# Altium schematic sheet 28pins_Antariksh_unoR3_V1I1_Schematic.SchDoc (part 4 of 5)
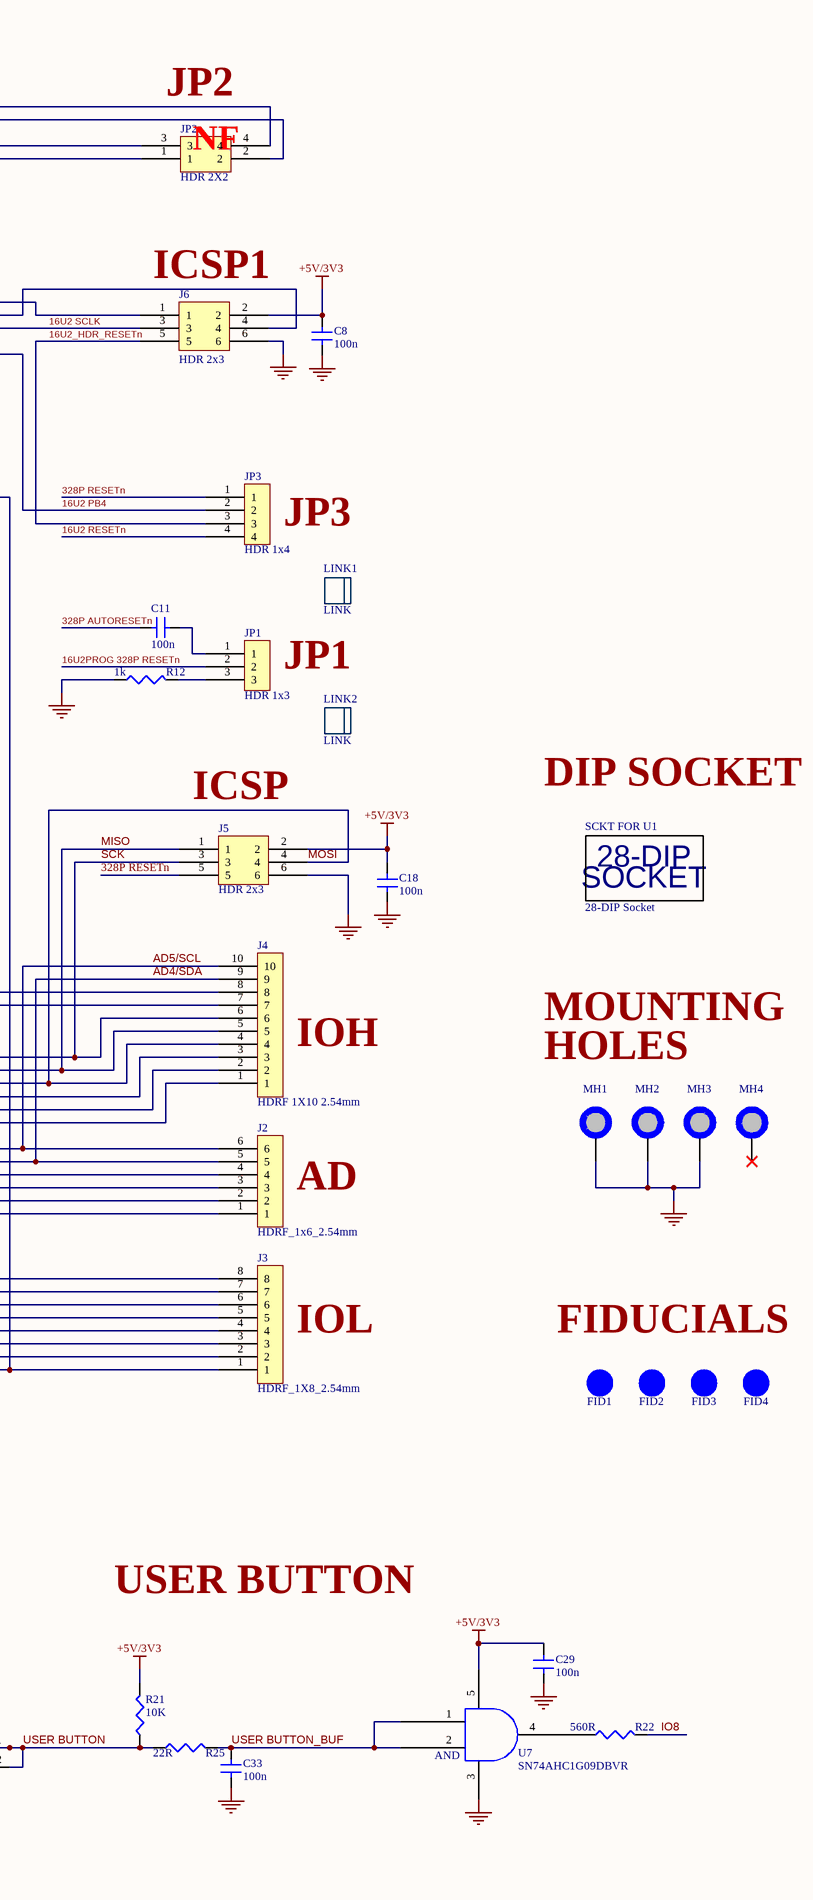
[diagram p4: 28pins_Antariksh_unoR3_V1I1_Schematic.SchDoc, right]

## Library data of the parts (continued)
R9 R16 = RC0805FR-071ML: 125Mw Thick Film Resistors 100Ppm/ 1% 1M 0805 Chip Resistor Surface Mount Rohs; Manufacturer: Yageo Group; Resistance: 1MΩ; Temperature Coefficient: 100ppm/°C; Voltage Rating: 150V; Supplier 1: Avnet; Manufacturer Part Number: RC0805FR-071ML; RoHS: Compliant; Category: Chip SMD Resistors; Stock 1: 5000; Pricing 1: 5000=0.00231, 10000=0.00225, 20000=0.0022, 30000=0.00216, 40000=0.00211 (USD); Case/Package: 0805; Case Code (Imperial): 0805; China RoHS: Non-Compliant; Composition: Thick Film; Depth: 1.25mm; Features: Moisture Resistant; Height: 500µm; Lead Free: Lead Free; Length: 2mm; Lifecycle Status: Production; Max Operating Temperature: 155°C; Max Power Dissipation: 125mW; Military Standard: Not; Min Operating Temperature: -55°C; Mount: Surface Mount; Number of Pins: 2; Number of Terminals: 2; Number of Terminations: 2; Packaging: Tape & Reel; Power Dissipation: 125mW; Power Rating: 125mW; REACH SVHC: Yes; Schedule B: 8533210045, 8533210045|8533210045, 8533210045|8533210045|8533210045, 8533210045|8533210045|8533210045|8533210045; Termination: SMD/SMT; Tolerance: 1%; Voltage Rating (AC): 150V; Voltage Rating (DC): 150V; Width: 1.25mm; Working Voltage: 150V; ComponentLink1URL: https://datasheet.octopart.com:443/RC0805FR-071ML-Yageo-datasheet-175887523.pdf?src-supplier=IHS; ComponentLink1Description: https://datasheet.octopart.com:443/RC0805FR-071ML-Yageo-datasheet-175887523.pdf?src-supplier=IHS; ComponentLink2URL: https://datasheet.octopart.com:443/RC0805FR-071ML-Yageo-datasheet-103092701.pdf?src-supplier=Upverter; ComponentLink2Description: https://datasheet.octopart.com:443/RC0805FR-071ML-Yageo-datasheet-103092701.pdf?src-supplier=Upverter; ComponentLink3URL: https://datasheet.octopart.com:443/RC0805FR-071ML-Yageo-datasheet-79472498.pdf?src-supplier=Upverter; ComponentLink3Description: https://datasheet.octopart.com:443/RC0805FR-071ML-Yageo-datasheet-79472498.pdf?src-supplier=Upverter; ComponentLink4URL: https://datasheet.octopart.com:443/RC0805FR-071ML-Yageo-datasheet-8330313.pdf?src-supplier=element14+APAC; ComponentLink4Description: https://datasheet.octopart.com:443/RC0805FR-071ML-Yageo-datasheet-8330313.pdf?src-supplier=element14+APAC; ComponentLink5URL: https://datasheet.octopart.com:443/RC0805FR-071ML-Yageo-datasheet-62067350.pdf?src-supplier=Farnell; ComponentLink5Description: https://datasheet.octopart.com:443/RC0805FR-071ML-Yageo-datasheet-62067350.pdf?src-supplier=Farnell; ComponentLink6URL: https://datasheet.octopart.com:443/RC0805FR-071ML-Yageo-datasheet-13691069.pdf?src-supplier=Farnell; ComponentLink6Description: https://datasheet.octopart.com:443/RC0805FR-071ML-Yageo-datasheet-13691069.pdf?src-supplier=Farnell; ComponentLink7URL: https://datasheet.octopart.com:443/RC0805FR-071ML-Yageo-datasheet-164759695.pdf?src-supplier=Future+Electronics; ComponentLink7Description: https://datasheet.octopart.com:443/RC0805FR-071ML-Yageo-datasheet-164759695.pdf?src-supplier=Future+Electronics; ComponentLink8URL: https://datasheet.octopart.com:443/RC0805FR-071ML-Yageo-datasheet-127823281.pdf?src-supplier=Future+Electronics; ComponentLink8Description: https://datasheet.octopart.com:443/RC0805FR-071ML-Yageo-datasheet-127823281.pdf?src-supplier=Future+Electronics; ComponentLink9URL: https://datasheet.octopart.com:443/RC0805FR-071ML-Yageo-datasheet-137700087.pdf?src-supplier=Future+Electronics; ComponentLink9Description: https://datasheet.octopart.com:443/RC0805FR-071ML-Yageo-datasheet-137700087.pdf?src-supplier=Future+Electronics; ComponentLink10URL: https://datasheet.octopart.com:443/RC0805FR-071ML-Yageo-datasheet-12592811.pdf?src-supplier=Future+Electronics; ComponentLink10Description: https://datasheet.octopart.com:443/RC0805FR-071ML-Yageo-datasheet-12592811.pdf?src-supplier=Future+Electronics; ComponentLink11URL: https://datasheet.octopart.com:443/RC0805FR-071ML-Yageo-datasheet-8324252.pdf?src-supplier=Future+Electronics; ComponentLink11Description: https://datasheet.octopart.com:443/RC0805FR-071ML-Yageo-datasheet-8324252.pdf?src-supplier=Future+Electronics; ComponentLink12URL: https://datasheet.octopart.com/RC0805FR-071ML-Yageo-datasheet-73766026.pdf; ComponentLink12Description: https://datasheet.octopart.com/RC0805FR-071ML-Yageo-datasheet-73766026.pdf; ComponentLink13URL: https://datasheet.octopart.com:443/RC0805FR-071ML-Yageo-datasheet-118657.pdf?src-supplier=DigiKey; ComponentLink13Description: https://datasheet.octopart.com:443/RC0805FR-071ML-Yageo-datasheet-118657.pdf?src-supplier=DigiKey; ComponentLink14URL: https://datasheet.octopart.com:443/RC0805FR-071ML-Yageo-datasheet-502840.pdf?src-supplier=element14; ComponentLink14Description: https://datasheet.octopart.com:443/RC0805FR-071ML-Yageo-datasheet-502840.pdf?src-supplier=element14; ComponentLink15URL: http://sigma.octopart.com:80/rohs_statement/Yageo-company-2.pdf?src-supplier=Compliance+Statements; ComponentLink15Description: http://sigma.octopart.com:80/rohs_statement/Yageo-company-2.pdf?src-supplier=Compliance+Statements; ComponentLink16URL: http://sigma.octopart.com:80/conflict_mineral_statement/Yageo-company-3.pdf?src-supplier=Compliance+Statements; ComponentLink16Description: http://sigma.octopart.com:80/conflict_mineral_statement/Yageo-company-3.pdf?src-supplier=Compliance+Statements; Supplier Part Number 1: RC0805FR-071ML
R10-R12 = RC0805FR-071KL: 125Mw Thick Film Resistors 100Ppm/ 1% 1K 0805 Chip Resistor Surface Mount Rohs; Manufacturer: Yageo Group; Resistance: 1kΩ; Temperature Coefficient: 100ppm/°C; Voltage Rating: 150V; Supplier 1: Avnet; Manufacturer Part Number: RC0805FR-071KL; RoHS: Compliant; Category: Chip SMD Resistors; Stock 1: 2315000; Pricing 1: 5000=0.00231, 10000=0.00225, 20000=0.0022, 30000=0.00216, 40000=0.00211 (USD); Case/Package: 0805; Case Code (Imperial): 0805; China RoHS: Non-Compliant; Composition: Thick Film; Depth: 1.25mm; Features: Moisture Resistant; Height: 500µm; Lead Free: Lead Free; Length: 2mm; Lifecycle Status: Production; Max Operating Temperature: 155°C; Max Power Dissipation: 125mW; Military Standard: Not; Min Operating Temperature: -55°C; Mount: Surface Mount; Number of Pins: 2; Number of Terminals: 2; Number of Terminations: 2; Packaging: Tape & Reel; Power Dissipation: 125mW; Power Rating: 125mW; REACH SVHC: Yes; Schedule B: 8533210045, 8533210045|8533210045, 8533210045|8533210045|8533210045, 8533210045|8533210045|8533210045|8533210045; Termination: SMD/SMT; Tolerance: 1%; Voltage Rating (AC): 150V; Voltage Rating (DC): 150V; Width: 1.25mm; Working Voltage: 150V; ComponentLink1URL: https://datasheet.octopart.com:443/RC0805FR-071KL-Yageo-datasheet-175887523.pdf?src-supplier=IHS; ComponentLink1Description: https://datasheet.octopart.com:443/RC0805FR-071KL-Yageo-datasheet-175887523.pdf?src-supplier=IHS; ComponentLink2URL: https://datasheet.octopart.com:443/RC0805FR-071KL-Yageo-datasheet-103092701.pdf?src-supplier=Upverter; ComponentLink2Description: https://datasheet.octopart.com:443/RC0805FR-071KL-Yageo-datasheet-103092701.pdf?src-supplier=Upverter; ComponentLink3URL: https://datasheet.octopart.com:443/RC0805FR-071KL-Yageo-datasheet-8330313.pdf?src-supplier=element14+APAC; ComponentLink3Description: https://datasheet.octopart.com:443/RC0805FR-071KL-Yageo-datasheet-8330313.pdf?src-supplier=element14+APAC; ComponentLink4URL: https://datasheet.octopart.com:443/RC0805FR-071KL-Yageo-datasheet-62067350.pdf?src-supplier=element14+APAC; ComponentLink4Description: https://datasheet.octopart.com:443/RC0805FR-071KL-Yageo-datasheet-62067350.pdf?src-supplier=element14+APAC; ComponentLink5URL: https://datasheet.octopart.com:443/RC0805FR-071KL-Yageo-datasheet-12592811.pdf?src-supplier=element14+APAC; ComponentLink5Description: https://datasheet.octopart.com:443/RC0805FR-071KL-Yageo-datasheet-12592811.pdf?src-supplier=element14+APAC; ComponentLink6URL: https://datasheet.octopart.com:443/RC0805FR-071KL-Yageo-datasheet-164759695.pdf?src-supplier=Future+Electronics; ComponentLink6Description: https://datasheet.octopart.com:443/RC0805FR-071KL-Yageo-datasheet-164759695.pdf?src-supplier=Future+Electronics; ComponentLink7URL: https://datasheet.octopart.com:443/RC0805FR-071KL-Yageo-datasheet-8324252.pdf?src-supplier=Future+Electronics; ComponentLink7Description: https://datasheet.octopart.com:443/RC0805FR-071KL-Yageo-datasheet-8324252.pdf?src-supplier=Future+Electronics; ComponentLink8URL: https://datasheet.octopart.com:443/RC0805FR-071KL-Yageo-datasheet-79472498.pdf?src-supplier=Megastar; ComponentLink8Description: https://datasheet.octopart.com:443/RC0805FR-071KL-Yageo-datasheet-79472498.pdf?src-supplier=Megastar; ComponentLink9URL: https://datasheet.octopart.com/RC0805FR-071KL-Yageo-datasheet-73766026.pdf; ComponentLink9Description: https://datasheet.octopart.com/RC0805FR-071KL-Yageo-datasheet-73766026.pdf; ComponentLink10URL: https://datasheet.octopart.com:443/RC0805FR-071KL-Yageo-datasheet-13691069.pdf?src-supplier=Farnell; ComponentLink10Description: https://datasheet.octopart.com:443/RC0805FR-071KL-Yageo-datasheet-13691069.pdf?src-supplier=Farnell; ComponentLink11URL: https://datasheet.octopart.com:443/RC0805FR-071KL-Yageo-datasheet-118657.pdf?src-supplier=DigiKey; ComponentLink11Description: https://datasheet.octopart.com:443/RC0805FR-071KL-Yageo-datasheet-118657.pdf?src-supplier=DigiKey; ComponentLink12URL: https://datasheet.octopart.com:443/RC0805FR-071KL-Yageo-datasheet-502840.pdf?src-supplier=element14; ComponentLink12Description: https://datasheet.octopart.com:443/RC0805FR-071KL-Yageo-datasheet-502840.pdf?src-supplier=element14; ComponentLink13URL: http://sigma.octopart.com:80/rohs_statement/Yageo-company-2.pdf?src-supplier=Compliance+Statements; ComponentLink13Description: http://sigma.octopart.com:80/rohs_statement/Yageo-company-2.pdf?src-supplier=Compliance+Statements; ComponentLink14URL: http://sigma.octopart.com:80/conflict_mineral_statement/Yageo-company-3.pdf?src-supplier=Compliance+Statements; ComponentLink14Description: http://sigma.octopart.com:80/conflict_mineral_statement/Yageo-company-3.pdf?src-supplier=Compliance+Statements; Supplier Part Number 1: RC0805FR-071KL
SCKT_FOR_U1 = 4828-3004-CP: IC Socket, DIP28, 28 Contact(s), 2.54mm Term Pitch, 7.62mm Row Spacing, Solder; Manufacturer: 3M; Connector Type: DIP, Socket; Current Rating: 1A; Gender: Female; Insulation Resistance: 5GΩ; Number of Contacts: 28; Supplier 1: Avnet; Manufacturer Part Number: 4828-3004-CP; RoHS: Compliant; Category: Connectors; Stock 1: 1313; Pricing 1: 1=1.09, 10=0.958, 25=0.9, 50=0.863, 100=0.827 (USD); China RoHS: Compliant; Contact Material: Bronze; Contact Plating: Tin; Depth: 5.08mm; Housing Material: Glass; Lead Free: Lead Free; Length: 35.43mm; Lifecycle Status: Production; Max Operating Temperature: 85°C; Min Operating Temperature: -25°C; Mount: Through Hole; Number of Pins: 28; Number of Positions: 28; Number of Rows: 2; Orientation: Straight; Pitch: 2.54mm; REACH SVHC: Yes; Row Spacing: 7.62mm; Terminal Pitch: 2.54mm; Termination: Solder; Width: 10.16mm; ComponentLink1URL: https://datasheet.octopart.com:443/4828-3004-CP-3M-datasheet-11754339.pdf?src-supplier=element14+APAC; ComponentLink1Description: https://datasheet.octopart.com:443/4828-3004-CP-3M-datasheet-11754339.pdf?src-supplier=element14+APAC; ComponentLink2URL: https://datasheet.octopart.com:443/4828-3004-CP-3M-datasheet-125432.pdf?src-supplier=Verical; ComponentLink2Description: https://datasheet.octopart.com:443/4828-3004-CP-3M-datasheet-125432.pdf?src-supplier=Verical; ComponentLink3URL: https://datasheet.octopart.com:443/4828-3004-CP-3M-datasheet-110561487.pdf?src-supplier=RS+(Formerly+Allied+Electronics); ComponentLink3Description: https://datasheet.octopart.com:443/4828-3004-CP-3M-datasheet-110561487.pdf?src-supplier=RS+(Formerly+Allied+Electronics); ComponentLink4URL: https://datasheet.octopart.com:443/4828-3004-CP-3M-datasheet-12002015.pdf?src-supplier=RS+(Formerly+Allied+Electronics); ComponentLink4Description: https://datasheet.octopart.com:443/4828-3004-CP-3M-datasheet-12002015.pdf?src-supplier=RS+(Formerly+Allied+Electronics); ComponentLink5URL: http://sigma.octopart.com:80/conflict_mineral_statement/3M-company-24.pdf?src-supplier=Compliance+Statements; ComponentLink5Description: http://sigma.octopart.com:80/conflict_mineral_statement/3M-company-24.pdf?src-supplier=Compliance+Statements; Supplier Part Number 1: 34P8056
SW1 SW2 = 1825910-6: Switch Tactile OFF (ON) SPST Round Button PC Pins 0.05A 24VDC 1.57N Thru-Hole Loose; Manufacturer: TE Connectivity; Manufacturer Lifecycle Status: ACTIVE; Actuator Length: 1.397mm; Actuator Material: PBT, Polyacetal, Resin; Contact Current Rating: 50mA; Contact Resistance: 100mΩ; Electrical Life: 100kcycles; Illumination Type: Illuminated, Non-Illuminated; Max Voltage Rating (DC): 24V; Number of Positions: 1; Operating Force: 1.568N; Switch Function: Off-Mom; Switch Travel: 250µm; Supplier 1: Newark; Manufacturer Part Number: 1825910-6; RoHS: Compliant; Category: Pushbutton Switches; Stock 1: 140483; Pricing 1: 1=0.148, 10=0.135, 25=0.126, 100=0.115, 500=0.099, 1000=0.093, 2500=0.087, 5000=0.081 (USD); China RoHS: Compliant; Color: Black; Contact Material: Copper; Contact Plating: Silver; Current Rating: 50mA; ELV: Compliant; Height: 3.61mm; Housing Material: Nylon; Insulation Resistance: 100MΩ; Lead Free: Lead Free; Length: 5.99mm; Life (Cycles): 100kcycles; Lifecycle Status: Production; Material: Nylon; Max Current Rating: 50mA; Max Operating Temperature: 85°C; Mechanical Life: 100kcycles; Min Operating Temperature: -35°C; Mount: Through Hole; Orientation: Straight; Packaging: Bulk; REACH SVHC: Yes; Termination: PC Pin, PC Pins; Throw Configuration: SPST; Type: Switch; Voltage Rating (DC): 24V; Width: 6mm; ComponentLink1URL: https://datasheet.octopart.com:443/1825910-6-TE-Connectivity-datasheet-10294628.pdf?src-supplier=Newark; ComponentLink1Description: https://datasheet.octopart.com:443/1825910-6-TE-Connectivity-datasheet-10294628.pdf?src-supplier=Newark; ComponentLink2URL: https://datasheet.octopart.com:443/1825910-6-TE-Connectivity-datasheet-179971975.pdf?src-supplier=IHS; ComponentLink2Description: https://datasheet.octopart.com:443/1825910-6-TE-Connectivity-datasheet-179971975.pdf?src-supplier=IHS; ComponentLink3URL: https://datasheet.octopart.com:443/FSM4JH-TE-Connectivity---AMP-datasheet-512274.pdf?src-supplier=IHS; ComponentLink3Description: https://datasheet.octopart.com:443/FSM4JH-TE-Connectivity---AMP-datasheet-512274.pdf?src-supplier=IHS; ComponentLink4URL: https://datasheet.octopart.com:443/1825910-6-TE-Connectivity---Alcoswitch-datasheet-181441334.pdf?src-supplier=IHS; ComponentLink4Description: https://datasheet.octopart.com:443/1825910-6-TE-Connectivity---Alcoswitch-datasheet-181441334.pdf?src-supplier=IHS; ComponentLink5URL: https://datasheet.octopart.com:443/FSM4JH-TE-Connectivity-datasheet-181317608.pdf?src-supplier=IHS; ComponentLink5Description: https://datasheet.octopart.com:443/FSM4JH-TE-Connectivity-datasheet-181317608.pdf?src-supplier=IHS; ComponentLink6URL: https://sigma.octopart.com:443/101748000/technical_drawing/TE-Connectivity-1825910-6.pdf?src-supplier=Sager+Electronics; ComponentLink6Description: https://sigma.octopart.com:443/101748000/technical_drawing/TE-Connectivity-1825910-6.pdf?src-supplier=Sager+Electronics; ComponentLink7URL: https://sigma.octopart.com:443/12291753/technical_drawing/TE-Connectivity-1825910-6.pdf?src-supplier=Burklin+Elektronik; ComponentLink7Description: https://sigma.octopart.com:443/12291753/technical_drawing/TE-Connectivity-1825910-6.pdf?src-supplier=Burklin+Elektronik; ComponentLink8URL: https://datasheet.octopart.com:443/FSM4JH-Tyco-Electronics-datasheet-5302851.pdf?src-supplier=Upverter; ComponentLink8Description: https://datasheet.octopart.com:443/FSM4JH-Tyco-Electronics-datasheet-5302851.pdf?src-supplier=Upverter; ComponentLink9URL: https://sigma.octopart.com:443/58177301/technical_drawing/TE-Connectivity-1825910-6.pdf?src-supplier=TE+Connectivity; ComponentLink9Description: https://sigma.octopart.com:443/58177301/technical_drawing/TE-Connectivity-1825910-6.pdf?src-supplier=TE+Connectivity; ComponentLink10URL: https://datasheet.octopart.com:443/1825910-6-TE-Connectivity-datasheet-33021037.pdf?src-supplier=Farnell; ComponentLink10Description: https://datasheet.octopart.com:443/1825910-6-TE-Connectivity-datasheet-33021037.pdf?src-supplier=Farnell; ComponentLink11URL: https://datasheet.octopart.com:443/FSM4JH-Tyco-Electronics-datasheet-12163206.pdf?src-supplier=Farnell; ComponentLink11Description: https://datasheet.octopart.com:443/FSM4JH-Tyco-Electronics-datasheet-12163206.pdf?src-supplier=Farnell; ComponentLink12URL: https://datasheet.octopart.com:443/FSM4JH-Alcoswitch-datasheet-41434433.pdf?src-supplier=Master+Electronics; ComponentLink12Description: https://datasheet.octopart.com:443/FSM4JH-Alcoswitch-datasheet-41434433.pdf?src-supplier=Master+Electronics; ComponentLink13URL: https://datasheet.octopart.com:443/1825910-6-TE-Connectivity---AMP-datasheet-189108451.pdf?src-supplier=Master+Electronics; ComponentLink13Description: https://datasheet.octopart.com:443/1825910-6-TE-Connectivity---AMP-datasheet-189108451.pdf?src-supplier=Master+Electronics; ComponentLink14URL: https://datasheet.octopart.com:443/1825910-6-TE-Connectivity-datasheet-145419878.pdf?src-supplier=RS+(Formerly+Allied+Electronics); ComponentLink14Description: https://datasheet.octopart.com:443/1825910-6-TE-Connectivity-datasheet-145419878.pdf?src-supplier=RS+(Formerly+Allied+Electronics); ComponentLink15URL: https://datasheet.octopart.com:443/FSM4JH-Agastat-datasheet-15984561.pdf?src-supplier=RS+(Formerly+Allied+Electronics); ComponentLink15Description: https://datasheet.octopart.com:443/FSM4JH-Agastat-datasheet-15984561.pdf?src-supplier=RS+(Formerly+Allied+Electronics); ComponentLink16URL: https://datasheet.octopart.com:443/1825910-6-TE-Connectivity-datasheet-140613545.pdf?src-supplier=TME; ComponentLink16Description: https://datasheet.octopart.com:443/1825910-6-TE-Connectivity-datasheet-140613545.pdf?src-supplier=TME; ComponentLink17URL: https://datasheet.octopart.com:443/1825910-6-TE-Connectivity---AMP-datasheet-23715110.pdf?src-supplier=Electro+Sonic; ComponentLink17Description: https://datasheet.octopart.com:443/1825910-6-TE-Connectivity---AMP-datasheet-23715110.pdf?src-supplier=Electro+Sonic; ComponentLink18URL: http://sigma.octopart.com:80/14574207/rohs_statement/TE-Connectivity-1825910-6.pdf?src-supplier=Compliance+Statements; ComponentLink18Description: http://sigma.octopart.com:80/14574207/rohs_statement/TE-Connectivity-1825910-6.pdf?src-supplier=Compliance+Statements; ComponentLink19URL: http://sigma.octopart.com:80/41598133/materials_sheet/TE-Connectivity-1825910-6.pdf?src-supplier=Compliance+Statements; ComponentLink19Description: http://sigma.octopart.com:80/41598133/materials_sheet/TE-Connectivity-1825910-6.pdf?src-supplier=Compliance+Statements; ComponentLink20URL: http://sigma.octopart.com:80/78006367/materials_sheet/TE-Connectivity-1825910-6.pdf?src-supplier=Compliance+Statements; ComponentLink20Description: http://sigma.octopart.com:80/78006367/materials_sheet/TE-Connectivity-1825910-6.pdf?src-supplier=Compliance+Statements; ComponentLink21URL: http://sigma.octopart.com:80/136693561/materials_sheet/TE-Connectivity-1825910-6.pdf?src-supplier=Compliance+Statements; ComponentLink21Description: http://sigma.octopart.com:80/136693561/materials_sheet/TE-Connectivity-1825910-6.pdf?src-supplier=Compliance+Statements; ComponentLink22URL: http://sigma.octopart.com:80/14555950/rohs_certificate/Agastat-FSM4JH.pdf?src-supplier=Compliance+Statements; ComponentLink22Description: http://sigma.octopart.com:80/14555950/rohs_certificate/Agastat-FSM4JH.pdf?src-supplier=Compliance+Statements; Supplier Part Number 1: 30AC3537
U1 = ATMEGA328P-PU: Microchip - ATMEGA328P-PU - Microcontroller Mcu, 8 Bit, Atmega, 20MHZ, DIP-28; Core Architecture: AVR; Data Bus Width: 8b; Interface: 2-Wire, I2C, SPI, UART, USART; Max Supply Voltage: 5.5V; Memory Size: 32kB; Memory Type: FLASH; Min Supply Voltage: 1.8V; Number of ADC Channels: 6; Number of I2C Channels: 1; Number of I/Os: 23; Number of Timers/Counters: 3; Oscillator Type: Internal; Peripherals: Brown-out Detect/Reset, POR, PWM, WDT; RAM Size: 2kB; Watchdog Timer: Yes; Supplier 1: Arrow Electronics; Manufacturer: Microchip; Manufacturer Part Number: ATMEGA328P-PU; RoHS: Compliant; Category: Microcontrollers; Stock 1: 6566; Pricing 1: 14=2.576 (USD); Projected EOL Date: 2039-11-04; Case/Package: PDIP; Contact Plating: Tin; Country of Assembly: Thailand; Country of Fabrication: United States of America; Country of Origin: Thailand; Export Control Classification Number (ECCN) Code: EAR99; Frequency: 20MHz; Height: 3.28mm; Harmonized Tariff Schedule (HTS) Code: 8542.31.0015; Lead Free: Lead Free; Length: 37.4mm; Lifecycle Status: Production; Max Frequency: 20MHz; Max Operating Temperature: 85°C; Min Operating Temperature: -40°C; Mount: Through Hole; Number of Pins: 28; Number of Programmable I/O: 23; Number of PWM Channels: 6; Number of SPI Channels: 1; Radiation Hardening: No; REACH SVHC: No; Schedule B: 8542310000, 8542310000|8542310000|8542310000|8542310000|8542310000; Width: 6.76mm; ComponentLink1URL: https://datasheet.octopart.com:443/ATMEGA328P-PU-Atmel-datasheet-34147914.pdf?src-supplier=Upverter; ComponentLink1Description: https://datasheet.octopart.com:443/ATMEGA328P-PU-Atmel-datasheet-34147914.pdf?src-supplier=Upverter; ComponentLink2URL: https://datasheet.octopart.com:443/ATMEGA328P-PU-Microchip-datasheet-14421303.pdf?src-supplier=Upverter; ComponentLink2Description: https://datasheet.octopart.com:443/ATMEGA328P-PU-Microchip-datasheet-14421303.pdf?src-supplier=Upverter; ComponentLink3URL: https://datasheet.octopart.com:443/ATMEGA328P-PU-Atmel-datasheet-14353408.pdf?src-supplier=Upverter; ComponentLink3Description: https://datasheet.octopart.com:443/ATMEGA328P-PU-Atmel-datasheet-14353408.pdf?src-supplier=Upverter; ComponentLink4URL: https://datasheet.octopart.com:443/ATMEGA328P-PU-Microchip-datasheet-68295846.pdf?src-supplier=SHENGYU+ELECTRONICS; ComponentLink4Description: https://datasheet.octopart.com:443/ATMEGA328P-PU-Microchip-datasheet-68295846.pdf?src-supplier=SHENGYU+ELECTRONICS; ComponentLink5URL: https://datasheet.octopart.com:443/ATMEGA328P-PU-Microchip-datasheet-133520744.pdf?src-supplier=LKR; ComponentLink5Description: https://datasheet.octopart.com:443/ATMEGA328P-PU-Microchip-datasheet-133520744.pdf?src-supplier=LKR; ComponentLink6URL: https://datasheet.octopart.com:443/ATMEGA328P-PU-Microchip-datasheet-62316222.pdf?src-supplier=element14+APAC; ComponentLink6Description: https://datasheet.octopart.com:443/ATMEGA328P-PU-Microchip-datasheet-62316222.pdf?src-supplier=element14+APAC; ComponentLink7URL: https://datasheet.octopart.com:443/ATMEGA328P-PU-Atmel-datasheet-13381135.pdf?src-supplier=element14+APAC; ComponentLink7Description: https://datasheet.octopart.com:443/ATMEGA328P-PU-Atmel-datasheet-13381135.pdf?src-supplier=element14+APAC; ComponentLink8URL: https://datasheet.octopart.com:443/ATMEGA328P-PU-Microchip-datasheet-147334532.pdf?src-supplier=Microchip; ComponentLink8Description: https://datasheet.octopart.com:443/ATMEGA328P-PU-Microchip-datasheet-147334532.pdf?src-supplier=Microchip; ComponentLink9URL: https://datasheet.octopart.com:443/ATMEGA328P-PU-Microchip-datasheet-148646239.pdf?src-supplier=Microchip; ComponentLink9Description: https://datasheet.octopart.com:443/ATMEGA328P-PU-Microchip-datasheet-148646239.pdf?src-supplier=Microchip; ComponentLink10URL: https://datasheet.octopart.com:443/ATMEGA328P-PU-Microchip-datasheet-154741723.pdf?src-supplier=Electro+Sonic; ComponentLink10Description: https://datasheet.octopart.com:443/ATMEGA328P-PU-Microchip-datasheet-154741723.pdf?src-supplier=Electro+Sonic; ComponentLink11URL: https://datasheet.octopart.com:443/ATMEGA328P-PU-Microchip-datasheet-100453898.pdf?src-supplier=Burklin+Elektronik; ComponentLink11Description: https://datasheet.octopart.com:443/ATMEGA328P-PU-Microchip-datasheet-100453898.pdf?src-supplier=Burklin+Elektronik; ComponentLink12URL: https://datasheet.octopart.com:443/ATMEGA328P-PU-Atmel-datasheet-30457899.pdf?src-supplier=Seeed+Studio; ComponentLink12Description: https://datasheet.octopart.com:443/ATMEGA328P-PU-Atmel-datasheet-30457899.pdf?src-supplier=Seeed+Studio; ComponentLink13URL: https://datasheet.octopart.com:443/ATMEGA328P-PU-Microchip-datasheet-10842036.pdf?src-supplier=SOS+electronic; ComponentLink13Description: https://datasheet.octopart.com:443/ATMEGA328P-PU-Microchip-datasheet-10842036.pdf?src-supplier=SOS+electronic; ComponentLink14URL: https://datasheet.octopart.com:443/ATMEGA328P-PU-Microchip-datasheet-8364063.pdf?src-supplier=Jameco; ComponentLink14Description: https://datasheet.octopart.com:443/ATMEGA328P-PU-Microchip-datasheet-8364063.pdf?src-supplier=Jameco; ComponentLink15URL: https://datasheet.octopart.com:443/ATMEGA328P-PU-Microchip-datasheet-154323124.pdf?src-supplier=Jameco; ComponentLink15Description: https://datasheet.octopart.com:443/ATMEGA328P-PU-Microchip-datasheet-154323124.pdf?src-supplier=Jameco; ComponentLink16URL: https://datasheet.octopart.com:443/ATMEGA328P-PU-Atmel-datasheet-10389530.pdf?src-supplier=Newark; ComponentLink16Description: https://datasheet.octopart.com:443/ATMEGA328P-PU-Atmel-datasheet-10389530.pdf?src-supplier=Newark; ComponentLink17URL: https://datasheet.octopart.com:443/ATMEGA328P-PU-Microchip-datasheet-65729177.pdf?src-supplier=TME; ComponentLink17Description: https://datasheet.octopart.com:443/ATMEGA328P-PU-Microchip-datasheet-65729177.pdf?src-supplier=TME; ComponentLink18URL: https://datasheet.octopart.com:443/ATMEGA328P-PU-Microchip-datasheet-101746195.pdf?src-supplier=Future+Electronics; ComponentLink18Description: https://datasheet.octopart.com:443/ATMEGA328P-PU-Microchip-datasheet-101746195.pdf?src-supplier=Future+Electronics; ComponentLink19URL: http://sigma.octopart.com:80/188450569/materials_sheet/Microchip-ATMEGA328P-PU.pdf?src-supplier=Compliance+Statements; ComponentLink19Description: http://sigma.octopart.com:80/188450569/materials_sheet/Microchip-ATMEGA328P-PU.pdf?src-supplier=Compliance+Statements; ComponentLink20URL: http://sigma.octopart.com:80/conflict_mineral_statement/Microchip-company-68.pdf?src-supplier=Compliance+Statements; ComponentLink20Description: http://sigma.octopart.com:80/conflict_mineral_statement/Microchip-company-68.pdf?src-supplier=Compliance+Statements; ComponentLink21URL: http://sigma.octopart.com:80/conflict_mineral_statement/Microchip-company-69.pdf?src-supplier=Compliance+Statements; ComponentLink21Description: http://sigma.octopart.com:80/conflict_mineral_statement/Microchip-company-69.pdf?src-supplier=Compliance+Statements; ComponentLink22URL: http://sigma.octopart.com:80/reach_statement/Microchip-company-70.pdf?src-supplier=Compliance+Statements; ComponentLink22Description: http://sigma.octopart.com:80/reach_statement/Microchip-company-70.pdf?src-supplier=Compliance+Statements; ComponentLink23URL: http://sigma.octopart.com:80/rohs_statement/Microchip-company-71.pdf?src-supplier=Compliance+Statements; ComponentLink23Description: http://sigma.octopart.com:80/rohs_statement/Microchip-company-71.pdf?src-supplier=Compliance+Statements; ComponentLink24URL: http://sigma.octopart.com:80/rohs_statement/Atmel-company-4.pdf?src-supplier=Compliance+Statements; ComponentLink24Description: http://sigma.octopart.com:80/rohs_statement/Atmel-company-4.pdf?src-supplier=Compliance+Statements; ComponentLink25URL: http://sigma.octopart.com:80/rohs_statement/Atmel-company-5.pdf?src-supplier=Compliance+Statements; ComponentLink25Description: http://sigma.octopart.com:80/rohs_statement/Atmel-company-5.pdf?src-supplier=Compliance+Statements; ComponentLink26URL: http://sigma.octopart.com:80/reach_statement/Atmel-company-6.pdf?src-supplier=Compliance+Statements; ComponentLink26Description: http://sigma.octopart.com:80/reach_statement/Atmel-company-6.pdf?src-supplier=Compliance+Statements; Supplier Part Number 1: ATMEGA328P-PU
U2 = ATMEGA16U2-AU: Risc Microcontroller, 8-BIT, Flash, AVR Risc Cpu, 16MHZ, Cmos, PQFP32; Manufacturer: Microchip; Data Bus Width: 8b; Interface: SPI, Serial, UART, USART, USB; Max Supply Voltage: 5.5V; Memory Size: 16kB; Min Supply Voltage: 2.7V; Number of I/Os: 22; Number of PWM Channels: 5; Number of SPI Channels: 1; Number of Timers/Counters: 2; Oscillator Type: Internal; Peripherals: Brown-out Detect/Reset, POR, PWM, WDT; RAM Size: 512B; Watchdog Timer: Yes; Supplier 1: Newark; Manufacturer Part Number: ATMEGA16U2-AU; RoHS: Compliant; Category: Microcontrollers; Stock 1: 3017; Pricing 1: 1=3.24, 10=3.11, 25=2.97, 50=2.84, 100=2.7 (USD); Projected EOL Date: 2039-11-08; Case/Package: TQFP; Contact Plating: Tin; Core Architecture: AVR; Country of Assembly: Philippines; Country of Fabrication: United States of America; Country of Origin: Philippines; Export Control Classification Number (ECCN) Code: EAR99; Frequency: 16MHz; Height: 1.05mm; Harmonized Tariff Schedule (HTS) Code: 8542.31.0015; Lead Free: Lead Free; Length: 7mm; Lifecycle Status: Production; Max Frequency: 16MHz; Max Operating Temperature: 85°C; Memory Type: FLASH; Min Operating Temperature: -40°C; Mount: Surface Mount; Number of Pins: 32; Number of Programmable I/O: 22; REACH SVHC: No; Schedule B: 8542310000, 8542310000|8542310000|8542310000|8542310000|8542310000|8542310000|8542310000|8542310000|8542310000|8542310000|8542310000|8542310000|8542310000|8542310000|8542310000|8542310000|8542310000|8542310000|8542310000|8542310000|8542310000|8542310000|8542310000|85; Width: 7mm; ComponentLink1URL: https://datasheet.octopart.com:443/ATMEGA16U2-AU-Microchip-datasheet-14435305.pdf?src-supplier=LKR; ComponentLink1Description: https://datasheet.octopart.com:443/ATMEGA16U2-AU-Microchip-datasheet-14435305.pdf?src-supplier=LKR; ComponentLink2URL: https://datasheet.octopart.com:443/ATMEGA16U2-AU-Microchip-datasheet-13413706.pdf?src-supplier=Farnell; ComponentLink2Description: https://datasheet.octopart.com:443/ATMEGA16U2-AU-Microchip-datasheet-13413706.pdf?src-supplier=Farnell; ComponentLink3URL: https://datasheet.octopart.com:443/ATMEGA16U2-AU-Microchip-datasheet-175858400.pdf?src-supplier=Microchip; ComponentLink3Description: https://datasheet.octopart.com:443/ATMEGA16U2-AU-Microchip-datasheet-175858400.pdf?src-supplier=Microchip; ComponentLink4URL: https://datasheet.octopart.com:443/ATMEGA16U2-AU-Atmel-datasheet-24967522.pdf?src-supplier=Newark; ComponentLink4Description: https://datasheet.octopart.com:443/ATMEGA16U2-AU-Atmel-datasheet-24967522.pdf?src-supplier=Newark; ComponentLink5URL: https://datasheet.octopart.com:443/ATMEGA16U2-AU-Atmel-datasheet-10031542.pdf?src-supplier=_legacy+Avnet; ComponentLink5Description: https://datasheet.octopart.com:443/ATMEGA16U2-AU-Atmel-datasheet-10031542.pdf?src-supplier=_legacy+Avnet; ComponentLink6URL: https://datasheet.octopart.com:443/ATMEGA16U2-AU-Atmel-datasheet-8702439.pdf?src-supplier=_legacy+Avnet; ComponentLink6Description: https://datasheet.octopart.com:443/ATMEGA16U2-AU-Atmel-datasheet-8702439.pdf?src-supplier=_legacy+Avnet; ComponentLink7URL: https://datasheet.octopart.com:443/ATMEGA16U2-AU-Atmel-datasheet-8367484.pdf?src-supplier=_legacy+Avnet; ComponentLink7Description: https://datasheet.octopart.com:443/ATMEGA16U2-AU-Atmel-datasheet-8367484.pdf?src-supplier=_legacy+Avnet; ComponentLink8URL: http://sigma.octopart.com:80/188450247/materials_sheet/Microchip-ATMEGA16U2-AU.pdf?src-supplier=Compliance+Statements; ComponentLink8Description: http://sigma.octopart.com:80/188450247/materials_sheet/Microchip-ATMEGA16U2-AU.pdf?src-supplier=Compliance+Statements; ComponentLink9URL: http://sigma.octopart.com:80/conflict_mineral_statement/Microchip-company-68.pdf?src-supplier=Compliance+Statements; ComponentLink9Description: http://sigma.octopart.com:80/conflict_mineral_statement/Microchip-company-68.pdf?src-supplier=Compliance+Statements; ComponentLink10URL: http://sigma.octopart.com:80/conflict_mineral_statement/Microchip-company-69.pdf?src-supplier=Compliance+Statements; ComponentLink10Description: http://sigma.octopart.com:80/conflict_mineral_statement/Microchip-company-69.pdf?src-supplier=Compliance+Statements; ComponentLink11URL: http://sigma.octopart.com:80/reach_statement/Microchip-company-70.pdf?src-supplier=Compliance+Statements; ComponentLink11Description: http://sigma.octopart.com:80/reach_statement/Microchip-company-70.pdf?src-supplier=Compliance+Statements; ComponentLink12URL: http://sigma.octopart.com:80/rohs_statement/Microchip-company-71.pdf?src-supplier=Compliance+Statements; ComponentLink12Description: http://sigma.octopart.com:80/rohs_statement/Microchip-company-71.pdf?src-supplier=Compliance+Statements; ComponentLink13URL: http://sigma.octopart.com:80/rohs_statement/Atmel-company-4.pdf?src-supplier=Compliance+Statements; ComponentLink13Description: http://sigma.octopart.com:80/rohs_statement/Atmel-company-4.pdf?src-supplier=Compliance+Statements; ComponentLink14URL: http://sigma.octopart.com:80/rohs_statement/Atmel-company-5.pdf?src-supplier=Compliance+Statements; ComponentLink14Description: http://sigma.octopart.com:80/rohs_statement/Atmel-company-5.pdf?src-supplier=Compliance+Statements; ComponentLink15URL: http://sigma.octopart.com:80/reach_statement/Atmel-company-6.pdf?src-supplier=Compliance+Statements; ComponentLink15Description: http://sigma.octopart.com:80/reach_statement/Atmel-company-6.pdf?src-supplier=Compliance+Statements; Supplier Part Number 1: 12T1292
U3 = TL1963A-33DCQR: LDO Regulator Pos 3.3V 1.5A 6-Pin(5+Tab) SOT-223 T/R; Manufacturer: Texas Instruments; Manufacturer Lifecycle Status: ACTIVE; Accuracy: 3%; Dropout Voltage: 340mV; Input Bias Current: 1mA; Max Input Voltage: 20V; Min Current Limit: 1.6A; Min Input Voltage: 2.1V; Number of Outputs: 1; Output Type: Fixed; Polarity: Positive; Supplier 1: Arrow Electronics; Manufacturer Part Number: TL1963A-33DCQR; RoHS: Compliant; Category: LDO Voltage Regulators; Stock 1: 589; Pricing 1: 1=1.945, 10=1.756, 25=1.691, 100=1.611, 250=1.567, 500=1.502 (USD); Case/Package: SOT-223; Contact Plating: Gold; Height: 0m; Lead Free: Lead Free; Length: 6.5mm; Lifecycle Status: Production; Max Operating Temperature: 125°C; Max Output Current: 1.5A; Max Output Voltage: 3.3V; Min Operating Temperature: -40°C; Min Output Voltage: 3.3V; Number of Pins: 6; Number of Regulators: 1; Output Current: 1.5A; Output Voltage: 3.3V; Packaging: Tape and Reel; Quiescent Current: 1mA; Radiation Hardening: No; Schedule B: 8542390000, 8542390000|8542390000|8542390000|8542390000|8542390000; Thickness: 1.6mm; Width: 3.5mm; ComponentLink1URL: https://sigma.octopart.com:443/157894086/technical_drawing/Texas-Instruments-TL1963A-33DCQR.pdf?src-supplier=Texas+Instruments; ComponentLink1Description: https://sigma.octopart.com:443/157894086/technical_drawing/Texas-Instruments-TL1963A-33DCQR.pdf?src-supplier=Texas+Instruments; ComponentLink2URL: https://octopart.com:443/opatz8j6/c1?t=DozhwpPHI70PqC1GtSQJWJGTnRIZ2wpYDJDba-dOvcNWIz764pPBWSnhv3jUDUGZaXhOYn4Hlx9QTyuurbG14Im81TGpsOiS0MoATHVfCpOlFHevYS6xpv1jwVJAwR79w0SWBezrML87NRuhiwo6fnZR_yQLmKz-V0GvAnr0RJVJayy7obJT7hdQoCQ_naoB5kRf3XmUFOun_0vMUq1Ki2Lh1i9O0AMIA6bOIMTnJGHnGFYENjymei2OXT8xlUmZAmL1sW8VsCT7iDhIQ4CxXasJF33VjCtBKG5HkoLf5hvwv8-vYIX04_caKVCEvy9beawfn8nY3tExjwILJdbDX-_Rdbysyiw__9j7hWBBehV9WyYQHDV5z8sLhsXtw7wu2kSkDqI&src-supplier=Texas+Instruments; ComponentLink2Description: https://octopart.com:443/opatz8j6/c1?t=DozhwpPHI70PqC1GtSQJWJGTnRIZ2wpYDJDba-dOvcNWIz764pPBWSnhv3jUDUGZaXhOYn4Hlx9QTyuurbG14Im81TGpsOiS0MoATHVfCpOlFHevYS6xpv1jwVJAwR79w0SWBezrML87NRuhiwo6fnZR_yQLmKz-V0GvAnr0RJVJayy7obJT7hdQoCQ_naoB5kRf3XmUFOun_0vMUq1Ki2Lh1i9O0AMIA6bOIMTnJGHnGFYENjymei2OXT8xlUmZAmL1sW8VsCT7iDhIQ4CxXasJF33VjCtBKG5HkoLf5hvwv8-vYIX04_caKVCEvy9beawfn8nY3tExjwILJdbDX-_Rdbysyiw__9j7hWBBehV9WyYQHDV5z8sLhsXtw7wu2kSkDqI&src-supplier=Texas+Instruments; ComponentLink3URL: https://datasheet.octopart.com:443/TL1963A-33DCQR-Texas-Instruments-datasheet-36835243.pdf?src-supplier=Texas+Instruments; ComponentLink3Description: https://datasheet.octopart.com:443/TL1963A-33DCQR-Texas-Instruments-datasheet-36835243.pdf?src-supplier=Texas+Instruments; ComponentLink4URL: https://sigma.octopart.com:443/49257225/technical_drawing/Texas-Instruments-TL1963A-33DCQR.pdf?src-supplier=Texas+Instruments; ComponentLink4Description: https://sigma.octopart.com:443/49257225/technical_drawing/Texas-Instruments-TL1963A-33DCQR.pdf?src-supplier=Texas+Instruments; ComponentLink5URL: https://datasheet.octopart.com:443/TL1963A-33DCQR-Texas-Instruments-datasheet-10255270.pdf?src-supplier=Texas+Instruments; ComponentLink5Description: https://datasheet.octopart.com:443/TL1963A-33DCQR-Texas-Instruments-datasheet-10255270.pdf?src-supplier=Texas+Instruments; ComponentLink6URL: https://datasheet.octopart.com:443/TL1963A-33DCQR-Texas-Instruments-datasheet-159117591.pdf?src-supplier=Augswan; ComponentLink6Description: https://datasheet.octopart.com:443/TL1963A-33DCQR-Texas-Instruments-datasheet-159117591.pdf?src-supplier=Augswan; ComponentLink7URL: http://sigma.octopart.com:80/reach_statement/Texas-Instruments-company-64.pdf?src-supplier=Compliance+Statements; ComponentLink7Description: http://sigma.octopart.com:80/reach_statement/Texas-Instruments-company-64.pdf?src-supplier=Compliance+Statements; ComponentLink8URL: http://sigma.octopart.com:80/conflict_mineral_statement/Texas-Instruments-company-63.pdf?src-supplier=Compliance+Statements; ComponentLink8Description: http://sigma.octopart.com:80/conflict_mineral_statement/Texas-Instruments-company-63.pdf?src-supplier=Compliance+Statements; Supplier Part Number 1: TL1963A-33DCQR
U4-U7 = SN74AHC1G09DBVR: 1-ch, 2-input 2-V to 5.5-V high-speed (9 ns) AND gate with open-drain outputs 5-SOT-23 -55 to 125; Manufacturer: Texas Instruments; Manufacturer Lifecycle Status: ACTIVE; Low Level Output Current: 8mA; Max Junction Temperature (Tj): 150°C; Max Supply Voltage: 5.5V; Min Supply Voltage: 2V; Nominal Supply Current: 1µA; Number of Bits: 1; Number of Inputs: 2; Output Current: 25mA; Propagation Delay: 4.6ns; Supplier 1: DigiKey; Manufacturer Part Number: SN74AHC1G09DBVR; RoHS: Compliant; Category: Logic Gates; Stock 1: 28931; Pricing 1: 1=0.12, 10=0.082, 25=0.0716, 100=0.0602, 250=0.05484, 500=0.05162, 1000=0.04896 (USD); Ambient Temperature Range High: 125°C; Case/Package: SOT-23; Contact Plating: Tin; Height: 1.45mm; Lead Free: Lead Free; Length: 2.9mm; Lifecycle Status: Production; Logic Function: AND; Max Operating Temperature: 125°C; Min Operating Temperature: -55°C; Mount: Surface Mount; Number of Channels: 1; Number of Circuits: 1; Number of Elements: 1; Number of Gates: 1; Number of Outputs: 1; Number of Pins: 5; Output Voltage: 5.5V; Quiescent Current: 1µA; Radiation Hardening: No; REACH SVHC: No; Schedule B: 8542390000, 8542390000|8542390000|8542390000|8542390000|8542390000; Thickness: 1.2mm; Width: 1.6mm; ComponentLink1URL: https://sigma.octopart.com:443/177332311/technical_drawing/Texas-Instruments-SN74AHC1G09DBVR.pdf?src-supplier=Texas+Instruments; ComponentLink1Description: https://sigma.octopart.com:443/177332311/technical_drawing/Texas-Instruments-SN74AHC1G09DBVR.pdf?src-supplier=Texas+Instruments; ComponentLink2URL: https://octopart.com:443/opatz8j6/c1?t=iLJebzXSq80NTQ6hr8alXlIfZAZzvDqdgcmqbFBMQIm06H_HDkW630Dv0poW1mda0vtXGKt1tbmz0rxQjQqzwGpR9Vct44E2qKJOYICkcXVw62on3DlvjdZsUICDa_W9dQn_TdG-vImRM8O0uOtU1V2YxRMFcN8QetaiFVJQUo3qkR2SntZDOCkrroQMurGFketygkwk04MYHykKZjNE2oNk8HFHY6VYuSx7oMjcDj3zLjpoposkn-GtK1R0TxzEnTg6iFVxZbnejqHEkGjX1hyBIqMXNKeaTEHsasTHmxIzaW5-2m_R3gFmmWSNs7Cy3xhP47rzxYqrSKi6kRb7Ah0zNDx2UGdFZPye3HFDE8ZAOc8bt2iTlK3tDIgdO4M7ZpSzEo2Qx50l&src-supplier=Texas+Instruments; ComponentLink2Description: https://octopart.com:443/opatz8j6/c1?t=iLJebzXSq80NTQ6hr8alXlIfZAZzvDqdgcmqbFBMQIm06H_HDkW630Dv0poW1mda0vtXGKt1tbmz0rxQjQqzwGpR9Vct44E2qKJOYICkcXVw62on3DlvjdZsUICDa_W9dQn_TdG-vImRM8O0uOtU1V2YxRMFcN8QetaiFVJQUo3qkR2SntZDOCkrroQMurGFketygkwk04MYHykKZjNE2oNk8HFHY6VYuSx7oMjcDj3zLjpoposkn-GtK1R0TxzEnTg6iFVxZbnejqHEkGjX1hyBIqMXNKeaTEHsasTHmxIzaW5-2m_R3gFmmWSNs7Cy3xhP47rzxYqrSKi6kRb7Ah0zNDx2UGdFZPye3HFDE8ZAOc8bt2iTlK3tDIgdO4M7ZpSzEo2Qx50l&src-supplier=Texas+Instruments; ComponentLink3URL: https://datasheet.octopart.com:443/SN74AHC1G09DBVR-Texas-Instruments-datasheet-37726925.pdf?src-supplier=Texas+Instruments; ComponentLink3Description: https://datasheet.octopart.com:443/SN74AHC1G09DBVR-Texas-Instruments-datasheet-37726925.pdf?src-supplier=Texas+Instruments; ComponentLink4URL: https://sigma.octopart.com:443/175570406/technical_drawing/Texas-Instruments-SN74AHC1G09DBVR.pdf?src-supplier=Texas+Instruments; ComponentLink4Description: https://sigma.octopart.com:443/175570406/technical_drawing/Texas-Instruments-SN74AHC1G09DBVR.pdf?src-supplier=Texas+Instruments; ComponentLink5URL: https://sigma.octopart.com:443/169406034/technical_drawing/Texas-Instruments-SN74AHC1G09DBVR.pdf?src-supplier=Texas+Instruments; ComponentLink5Description: https://sigma.octopart.com:443/169406034/technical_drawing/Texas-Instruments-SN74AHC1G09DBVR.pdf?src-supplier=Texas+Instruments; ComponentLink6URL: https://sigma.octopart.com:443/155939316/technical_drawing/Texas-Instruments-SN74AHC1G09DBVR.pdf?src-supplier=Texas+Instruments; ComponentLink6Description: https://sigma.octopart.com:443/155939316/technical_drawing/Texas-Instruments-SN74AHC1G09DBVR.pdf?src-supplier=Texas+Instruments; ComponentLink7URL: https://sigma.octopart.com:443/102331370/technical_drawing/Texas-Instruments-SN74AHC1G09DBVR.pdf?src-supplier=Texas+Instruments; ComponentLink7Description: https://sigma.octopart.com:443/102331370/technical_drawing/Texas-Instruments-SN74AHC1G09DBVR.pdf?src-supplier=Texas+Instruments; ComponentLink8URL: https://sigma.octopart.com:443/49249325/technical_drawing/Texas-Instruments-SN74AHC1G09DBVR.pdf?src-supplier=Texas+Instruments; ComponentLink8Description: https://sigma.octopart.com:443/49249325/technical_drawing/Texas-Instruments-SN74AHC1G09DBVR.pdf?src-supplier=Texas+Instruments; ComponentLink9URL: https://datasheet.octopart.com:443/SN74AHC1G09DBVR-Texas-Instruments-datasheet-21221312.pdf?src-supplier=Upverter; ComponentLink9Description: https://datasheet.octopart.com:443/SN74AHC1G09DBVR-Texas-Instruments-datasheet-21221312.pdf?src-supplier=Upverter; ComponentLink10URL: https://datasheet.octopart.com:443/SN74AHC1G09DBVR-Texas-Instruments-datasheet-62088831.pdf?src-supplier=Newark; ComponentLink10Description: https://datasheet.octopart.com:443/SN74AHC1G09DBVR-Texas-Instruments-datasheet-62088831.pdf?src-supplier=Newark; ComponentLink11URL: https://datasheet.octopart.com:443/SN74AHC1G09DBVR-Texas-Instruments-datasheet-33010737.pdf?src-supplier=Newark; ComponentLink11Description: https://datasheet.octopart.com:443/SN74AHC1G09DBVR-Texas-Instruments-datasheet-33010737.pdf?src-supplier=Newark; ComponentLink12URL: https://datasheet.octopart.com:443/SN74AHC1G09DBVR-Texas-Instruments-datasheet-159115775.pdf?src-supplier=SHENGYU+ELECTRONICS; ComponentLink12Description: https://datasheet.octopart.com:443/SN74AHC1G09DBVR-Texas-Instruments-datasheet-159115775.pdf?src-supplier=SHENGYU+ELECTRONICS; ComponentLink13URL: https://datasheet.octopart.com:443/SN74AHC1G09DBVR-Texas-Instruments-datasheet-165804331.pdf?src-supplier=LCSC; ComponentLink13Description: https://datasheet.octopart.com:443/SN74AHC1G09DBVR-Texas-Instruments-datasheet-165804331.pdf?src-supplier=LCSC; ComponentLink14URL: https://datasheet.octopart.com:443/SN74AHC1G09DBVR-Texas-Instruments-datasheet-140571641.pdf?src-supplier=Arrow.cn; ComponentLink14Description: https://datasheet.octopart.com:443/SN74AHC1G09DBVR-Texas-Instruments-datasheet-140571641.pdf?src-supplier=Arrow.cn; ComponentLink15URL: https://datasheet.octopart.com:443/SN74AHC1G09DBVR-Texas-Instruments-datasheet-11780427.pdf?src-supplier=Arrow+Electronics; ComponentLink15Description: https://datasheet.octopart.com:443/SN74AHC1G09DBVR-Texas-Instruments-datasheet-11780427.pdf?src-supplier=Arrow+Electronics; ComponentLink16URL: http://sigma.octopart.com:80/reach_statement/Texas-Instruments-company-64.pdf?src-supplier=Compliance+Statements; ComponentLink16Description: http://sigma.octopart.com:80/reach_statement/Texas-Instruments-company-64.pdf?src-supplier=Compliance+Statements; ComponentLink17URL: http://sigma.octopart.com:80/conflict_mineral_statement/Texas-Instruments-company-63.pdf?src-supplier=Compliance+Statements; ComponentLink17Description: http://sigma.octopart.com:80/conflict_mineral_statement/Texas-Instruments-company-63.pdf?src-supplier=Compliance+Statements; Supplier Part Number 1: 296-29202-1-ND
Y1 Y2 = ABM7-16.000MHZ-D2Y-T: Crystal 16MHz ±20ppm (Tol) ±30ppm (Stability) 18pF FUND 50Ohm 2-Pin Mini-CSMD T/R; Manufacturer: Abracon; ESR (Equivalent Series Resistance): 50Ω; Frequency Tolerance: 0.002%; Supplier 1: DigiKey; Manufacturer Part Number: ABM7-16.000MHZ-D2Y-T; RoHS: Compliant; Category: Crystals; Stock 1: 23267; Pricing 1: 1=0.64, 10=0.553, 25=0.5228, 50=0.501, 100=0.4803, 250=0.45424, 500=0.43544 (USD); Case/Package: CSMD; China RoHS: Non-Compliant; Composition: Ceramic; Depth: 3.5mm; Frequency: 16MHz; Frequency Stability: 30ppm; Height: 1.4mm; Lead Free: Lead Free; Length: 6mm; Lifecycle Status: Production; Load Capacitance: 18pF; Max Operating Temperature: 85°C; Min Operating Temperature: -40°C; Mount: Surface Mount; Number of Pins: 2; Radiation Hardening: No; REACH SVHC: Yes; Schedule B: 8541600025, 8541600025|8541600025|8541600025|8541600025|8541600025, 8541600080; Series Resistance: 50Ω; Termination: SMD/SMT; Tolerance: 0.002%; Width: 3.5mm; ComponentLink1URL: https://datasheet.octopart.com:443/ABM7-16.000MHZ-D2Y-T-Abracon-datasheet-103053454.pdf?src-supplier=ODG+(Origin+Data+Global); ComponentLink1Description: https://datasheet.octopart.com:443/ABM7-16.000MHZ-D2Y-T-Abracon-datasheet-103053454.pdf?src-supplier=ODG+(Origin+Data+Global); ComponentLink2URL: https://datasheet.octopart.com:443/ABM7-16.000MHZ-D2Y-T-Abracon-datasheet-10672703.pdf?src-supplier=Farnell; ComponentLink2Description: https://datasheet.octopart.com:443/ABM7-16.000MHZ-D2Y-T-Abracon-datasheet-10672703.pdf?src-supplier=Farnell; ComponentLink3URL: https://datasheet.octopart.com:443/ABM7-16.000MHZ-D2Y-T-Abracon-datasheet-8837364.pdf?src-supplier=Upverter; ComponentLink3Description: https://datasheet.octopart.com:443/ABM7-16.000MHZ-D2Y-T-Abracon-datasheet-8837364.pdf?src-supplier=Upverter; ComponentLink4URL: https://datasheet.octopart.com:443/ABM7-16.000MHZ-D2Y-T-Abracon-datasheet-8817375.pdf?src-supplier=Upverter; ComponentLink4Description: https://datasheet.octopart.com:443/ABM7-16.000MHZ-D2Y-T-Abracon-datasheet-8817375.pdf?src-supplier=Upverter; ComponentLink5URL: https://datasheet.octopart.com:443/ABM7-16.000MHZ-D2Y-T-Abracon-datasheet-8699803.pdf?src-supplier=Upverter; ComponentLink5Description: https://datasheet.octopart.com:443/ABM7-16.000MHZ-D2Y-T-Abracon-datasheet-8699803.pdf?src-supplier=Upverter; ComponentLink6URL: https://datasheet.octopart.com:443/ABM7-16.000MHZ-D2Y-T-Abracon-datasheet-8623263.pdf?src-supplier=Upverter; ComponentLink6Description: https://datasheet.octopart.com:443/ABM7-16.000MHZ-D2Y-T-Abracon-datasheet-8623263.pdf?src-supplier=Upverter; ComponentLink7URL: https://datasheet.octopart.com:443/ABM7-16.000MHZ-D2Y-T-Abracon-datasheet-8452219.pdf?src-supplier=Upverter; ComponentLink7Description: https://datasheet.octopart.com:443/ABM7-16.000MHZ-D2Y-T-Abracon-datasheet-8452219.pdf?src-supplier=Upverter; ComponentLink8URL: https://datasheet.octopart.com:443/ABM7-16.000MHZ-D2Y-T-Abracon-datasheet-8330406.pdf?src-supplier=Upverter; ComponentLink8Description: https://datasheet.octopart.com:443/ABM7-16.000MHZ-D2Y-T-Abracon-datasheet-8330406.pdf?src-supplier=Upverter; ComponentLink9URL: https://datasheet.octopart.com:443/ABM7-16.000MHZ-D2Y-T-Abracon-datasheet-5320088.pdf?src-supplier=Upverter; ComponentLink9Description: https://datasheet.octopart.com:443/ABM7-16.000MHZ-D2Y-T-Abracon-datasheet-5320088.pdf?src-supplier=Upverter; ComponentLink10URL: https://datasheet.octopart.com:443/ABM7-16.000MHZ-D2Y-T-Abracon-datasheet-157440075.pdf?src-supplier=Sager+Electronics; ComponentLink10Description: https://datasheet.octopart.com:443/ABM7-16.000MHZ-D2Y-T-Abracon-datasheet-157440075.pdf?src-supplier=Sager+Electronics; ComponentLink11URL: https://sigma.octopart.com:443/141159867/technical_drawing/Abracon-ABM7-16.000MHZ-D2Y-T.pdf?src-supplier=Abracon+SCT; ComponentLink11Description: https://sigma.octopart.com:443/141159867/technical_drawing/Abracon-ABM7-16.000MHZ-D2Y-T.pdf?src-supplier=Abracon+SCT; ComponentLink12URL: https://datasheet.octopart.com:443/ABM7-16.000MHZ-D2Y-T-Abracon-datasheet-15994676.pdf?src-supplier=TME; ComponentLink12Description: https://datasheet.octopart.com:443/ABM7-16.000MHZ-D2Y-T-Abracon-datasheet-15994676.pdf?src-supplier=TME; ComponentLink13URL: http://sigma.octopart.com:80/conflict_mineral_statement/Abracon-company-27.pdf?src-supplier=Compliance+Statements; ComponentLink13Description: http://sigma.octopart.com:80/conflict_mineral_statement/Abracon-company-27.pdf?src-supplier=Compliance+Statements; Supplier Part Number 1: 535-9840-1-ND